# EAGLE design 7 segment display breakout (EAGLE 7.2.0)
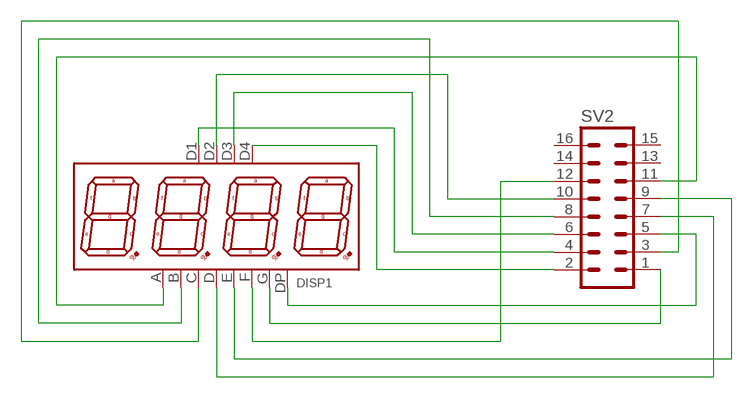
[diagram p0: schematic, sheet 1]

## Parts
DISP1  7-SEG_4D_0.36  [7SEG-4DIG]
SV2  MA08-2  [MA08-2]

## Nets
N$1: DISP1.C SV2.3
N$2: DISP1.D4 SV2.2
N$3: DISP1.D1 SV2.4
N$4: DISP1.D2 SV2.10
N$5: DISP1.D3 SV2.6
N$6: DISP1.DP SV2.5
N$7: DISP1.B SV2.8
N$8: DISP1.A SV2.11
N$9: DISP1.E SV2.9
N$10: DISP1.G SV2.1
N$11: DISP1.F SV2.12
N$12: DISP1.D SV2.7
Unconnected: SV2.13 SV2.14 SV2.15 SV2.16

## Library data of the parts
DISP1 = 7-seg_disp_0.36in:7-SEG_4D_0.36: 7-Segment 4-Digit Display 0.36" (9.11mm) Common Cathode. Created by David J. LEWIS (2015)
SV2 = con-lstb:MA08-2: PIN HEADER; OC_FARNELL: unknown; OC_NEWARK: unknown

## Board
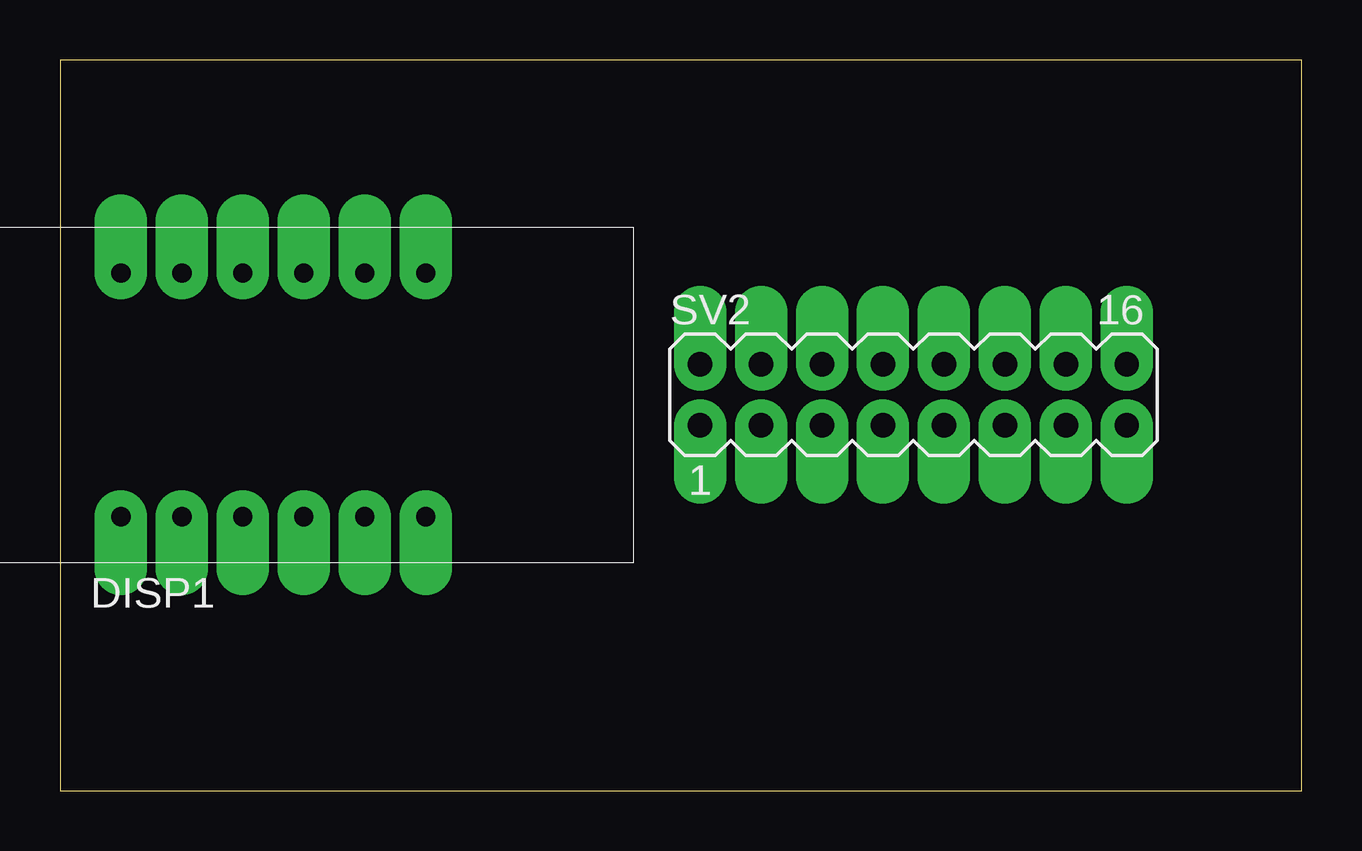
[diagram p1: board, top side]
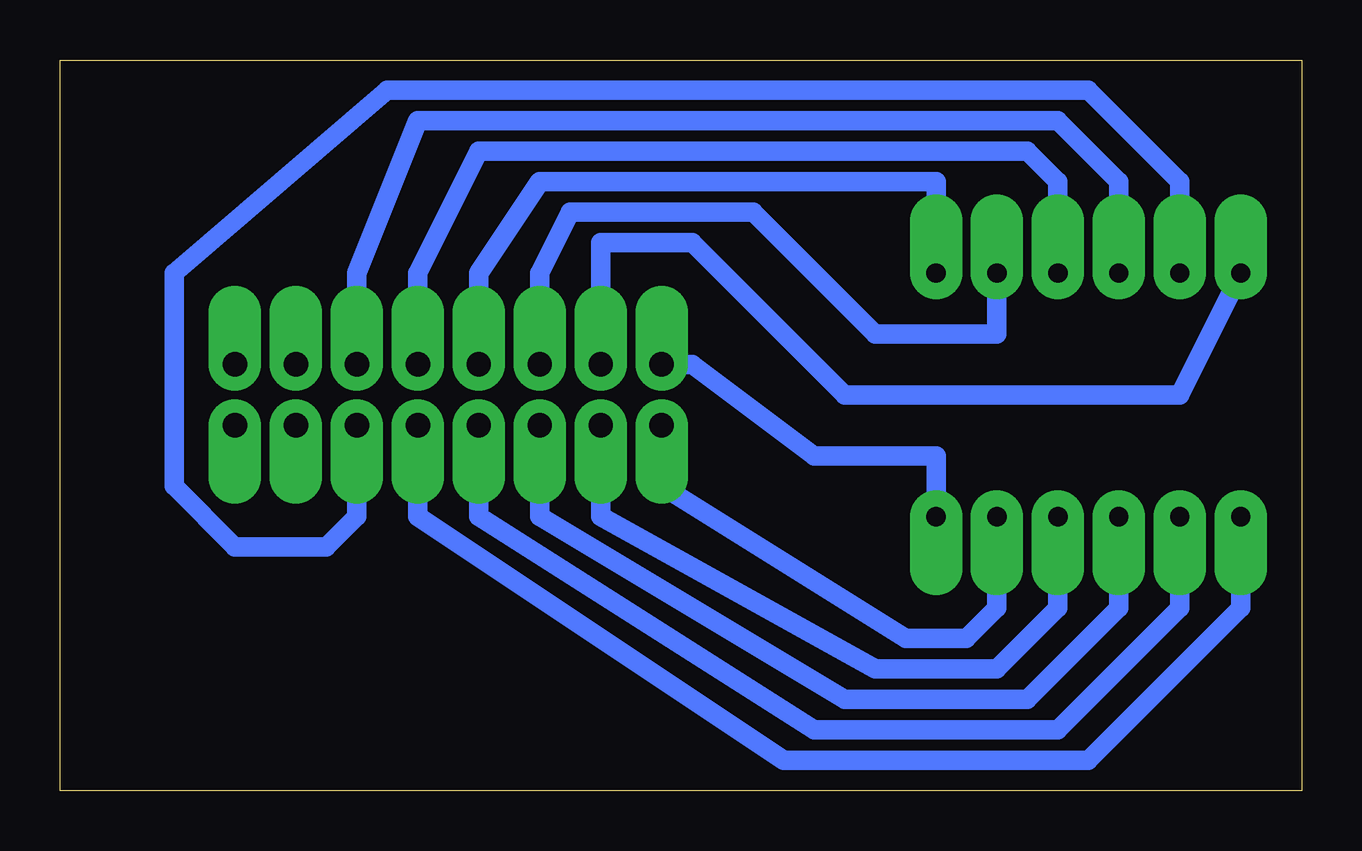
[diagram p2: board, bottom side, seen from below]

Size 51.74 x 30.47 mm. Coordinates in mm from the lower left corner, seen from the top.
Outline: 0,0 51.74,0 51.74,30.47 0,30.47 0,0
Copper layers (1*16): Top 0.035mm / dielectric 1.5mm / Bottom 0.035mm
Design rules "default": minimum track width 40mil, minimum drill 24mil, track to track 40mil, track to pad 40mil, pad to pad 40mil, via to via 40mil, smd to smd 8mil, copper to edge 40mil, drill to drill 8mil, minimum pad ring 10mil, minimum via ring 8mil, stop-mask expansion 4mil, vias tented up to drill 0mil, thermal gap 10mil

### Footprints (pad centres in the part's own frame; a part is rotated, then mirrored left to right if it is on the bottom)
7SEG-4DIG = drill 0.8 pad 2.184 offset: A -3.81,5.08; B 6.35,5.08; C 1.27,-5.08; D -3.81,-5.08; D1 -6.35,5.08; D2 1.27,5.08; D3 3.81,5.08; D4 6.35,-5.08; DP -1.27,-5.08; E -6.35,-5.08; F -1.27,5.08; G 3.81,-5.08
MA08-2 = drill 1.016 pad 2.184 offset: 1 -8.89,-1.27; 2 -8.89,1.27; 3 -6.35,-1.27; 4 -6.35,1.27; 5 -3.81,-1.27; 6 -3.81,1.27; 7 -1.27,-1.27; 8 -1.27,1.27; 9 1.27,-1.27; 10 1.27,1.27; 11 3.81,-1.27; 12 3.81,1.27; 13 6.35,-1.27; 14 6.35,1.27; 15 8.89,-1.27; 16 8.89,1.27

### Placement (x,y rotation side)
DISP1  8.89,16.51 0 top
SV2  35.56,16.51 0 top

### Tracks (layer width: path | path; a pad name or v marks a point on that pad's centre or on a via)
N$1
  Bottom 0.813: DISP1.C 10.16,7.62 12.7,5.08 17.78,5.08 29.21,11.43 SV2.3
N$2
  Bottom 0.813: DISP1.D4 15.24,13.97 20.32,13.97 25.4,17.78 SV2.2
N$3
  Bottom 0.813: DISP1.D1 5.08,16.51 19.05,16.51 25.4,22.86 29.21,22.86 SV2.4
N$4
  Bottom 0.813: DISP1.D2 10.16,25.4 11.43,26.67 34.29,26.67 36.83,21.59 SV2.10
N$5
  Bottom 0.813: DISP1.D3 12.7,19.05 17.78,19.05 22.86,24.13 30.48,24.13 31.75,21.59 SV2.6
N$6
  Bottom 0.813: DISP1.DP 7.62,7.62 11.43,3.81 19.05,3.81 31.75,11.43 SV2.5
N$7
  Bottom 0.813: DISP1.B 15.24,25.4 31.75,25.4 34.29,21.59 SV2.8
N$8
  Bottom 0.813: DISP1.A 5.08,25.4 8.89,29.21 38.1,29.21 46.99,21.59 46.99,12.7 44.45,10.16 40.64,10.16 39.37,11.43 SV2.11
N$9
  Bottom 0.813: DISP1.E 2.54,7.62 8.89,1.27 21.59,1.27 36.83,11.43 SV2.9
N$10
  Bottom 0.813: DISP1.G 12.7,7.62 13.97,6.35 16.51,6.35 26.67,12.7 SV2.1
N$11
  Bottom 0.813: DISP1.F 7.62,25.4 10.16,27.94 36.83,27.94 39.37,21.59 SV2.12
N$12
  Bottom 0.813: DISP1.D 5.08,7.62 10.16,2.54 20.32,2.54 34.29,11.43 SV2.7